# Altium schematic sheet TailLights.SchDoc
size Letter; Organization: Midnight Sun Solar Rayce Car Team; Address1: University of Waterloo; Address2: 200 University Ave W; Address3: Waterloo, ON, Canada; Address4: N2L 3E9; Website: www.uwmidsun.com
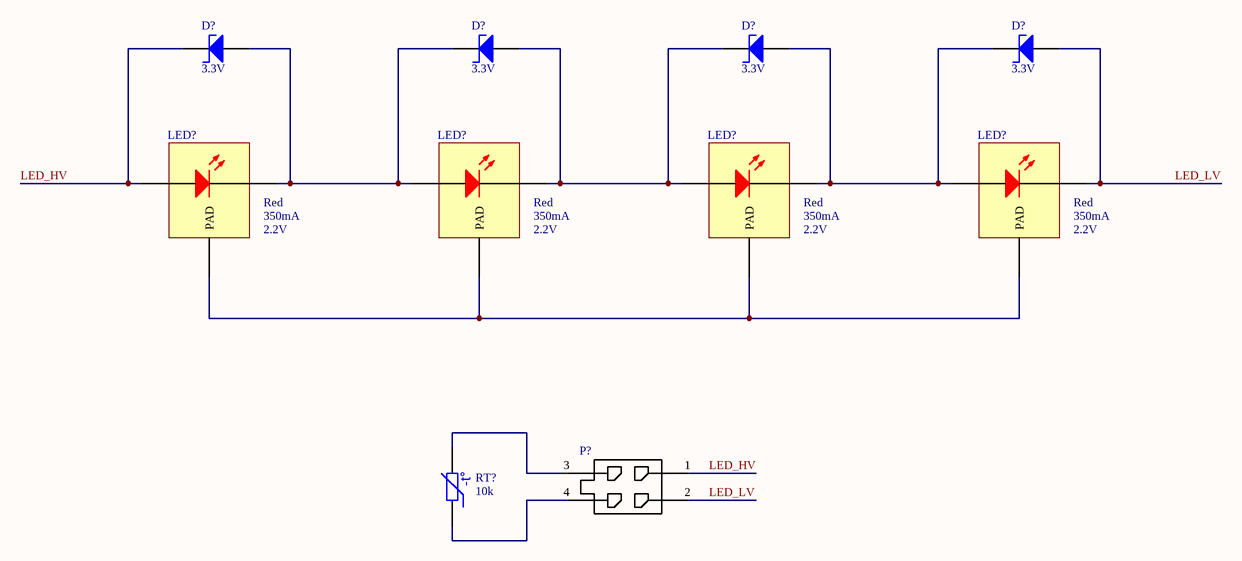
[diagram p0: TailLights.SchDoc]

## Parts
(Parts that share a designator on the sheet are numbered #1, #2 ... from top to bottom, then left to right.)
D?#1  Zener Voltage: 3.3V  [DO-214AA Diode]  (hidden comment: DIODE ZENER 3.3V 3W DO-214AA)
D?#2  Zener Voltage: 3.3V  [DO-214AA Diode]  (hidden comment: DIODE ZENER 3.3V 3W DO-214AA)
D?#3  Zener Voltage: 3.3V  [DO-214AA Diode]  (hidden comment: DIODE ZENER 3.3V 3W DO-214AA)
D?#4  Zener Voltage: 3.3V  [DO-214AA Diode]  (hidden comment: DIODE ZENER 3.3V 3W DO-214AA)
LED?#1  Color: Red  Test Current: 350mA  Forward Voltage: 2.2V  [LED XLAMP XP-E2 1414]  (hidden comment: LED RED XLAMP XP-E2 1414)
LED?#2  Color: Red  Test Current: 350mA  Forward Voltage: 2.2V  [LED XLAMP XP-E2 1414]  (hidden comment: LED RED XLAMP XP-E2 1414)
LED?#3  Color: Red  Test Current: 350mA  Forward Voltage: 2.2V  [LED XLAMP XP-E2 1414]  (hidden comment: LED RED XLAMP XP-E2 1414)
LED?#4  Color: Red  Test Current: 350mA  Forward Voltage: 2.2V  [LED XLAMP XP-E2 1414]  (hidden comment: LED RED XLAMP XP-E2 1414)
P?  CONN 4POS MICRO-FIT 3mm  [CONN 4POS MICROFIT (2x2)]  (value not drawn)
RT?  Resistance in Ohms @ 25°C: 10k  [RES, 0603]  (hidden comment: NTC THERMISTORS 10K 0603 SMD)

## Nets
LED_HV: D?#1.2(K) LED?#1.1(A) P?.1
LED_LV: D?#4.1(A) LED?#4.3(K) P?.2
NetD?#1_1: D?#1.1(A) D?#2.2(K) LED?#1.3(K) LED?#2.1(A)
NetD?#2_1: D?#2.1(A) D?#3.2(K) LED?#2.3(K) LED?#3.1(A)
NetD?#3_1: D?#3.1(A) D?#4.2(K) LED?#3.3(K) LED?#4.1(A)
NetLED?#1_2: LED?#1.2(PAD) LED?#2.2(PAD) LED?#3.2(PAD) LED?#4.2(PAD)
NetP?_3: P?.3 RT?.2
NetP?_4: P?.4 RT?.1

## Notes on the sheet
- Project:
- Title:
- Size:
- Project Author
- Letter
- Revision:
- University of Waterloo
- 200 University Ave W
- Waterloo, ON, Canada
- N2L 3E9
- Date:
- Sheet
- of
- Website:
- (in symbol NTC THERMISTORS 10K 0603 SMD) -t°

## Library data of the parts
D?#1-D?#4 = DIODE ZENER 3.3V 3W DO-214AA: Diode Zener Single 3.3V 5% 3000mW Automotive 2-Pin SMB T/R; Manufacturer: ON Semiconductor; Manufacturer Part Number: SZ1SMB5913BT3G; Max Power Dissipation: 550mW; Zener Current: 100uA; Forward Voltage: 1.5V; Impedance: 10R; Test Current: 113.6mA; Supplier 1: Digi-Key; RoHS: Yes; Category: Zener Diodes; Stock 1: 2894; Pricing 1: 1=0.62000, 10=0.54500, 25=0.51160, 100=0.37130, 250=0.35804, 500=0.31020, 1000=0.26400 (USD); Case/Package: SMB; Number of Pins: 2; Min Operating Temperature: -65°C; Max Operating Temperature: 150°C; Tolerance: 5%; Package Quantity: 2500; Peak Reverse Current: 100uA; Voltage Tolerance: 5%; Power Dissipation: 550mW; Max Reverse Leakage Current: 100uA; Element Configuration: Single; Packaging: Tape and Reel; Length: 4.32mm; Height: 2.3mm; Width: 3.56mm; Radiation Hardening: No; Lead Free: Lead Free; Halogen Free: Halogen Free; ComponentLink1URL: http://www.mouser.com/ds/2/308/1SMB5913BT3-D-108682.pdf?src-supplier=Mouser; ComponentLink1Description: http://www.mouser.com/ds/2/308/1SMB5913BT3-D-108682.pdf?src-supplier=Mouser; ComponentLink2URL: https://www.onsemi.com/pub/Collateral/1SMB5913BT3-D.PDF?src-supplier=Digi-Key; ComponentLink2Description: https://www.onsemi.com/pub/Collateral/1SMB5913BT3-D.PDF?src-supplier=Digi-Key; ComponentLink3URL: http://www.farnell.com/datasheets/2160707.pdf?src-supplier=Newark; ComponentLink3Description: http://www.farnell.com/datasheets/2160707.pdf?src-supplier=Newark; ComponentLink4URL: http://www.onsemi.com/pub/Collateral/1SMB5913BT3-D.PDF?src-supplier=Avnet; ComponentLink4Description: http://www.onsemi.com/pub/Collateral/1SMB5913BT3-D.PDF?src-supplier=Avnet; Supplier Part Number 1: SZ1SMB5913BT3GOSCT-ND
LED?#1-LED?#4 = LED RED XLAMP XP-E2 1414: LED Lighting Color XLamp® XP-E2 Red 623nm (620nm ~ 625nm) 1414 (3535 Metric); Manufacturer: Cree; Manufacturer Part Number: XPEBRD-L1-0000-00902; Max Current Rating: 1A; Test Temperature: 25°C; Viewing Angle: 130°; Thermal Resistance of Package: 5°C/W; Supplier 1: Digi-Key; Stock 1: 1640; Pricing 1: 1 = 2.00000, 10 = 1.90000, 100 = 1.69980, 250 = 1.54584, 500 = 1.44786 (USD); Mount: Surface Mount; Case/Package: SMD/SMT; Packaging: Tape and Reel; Wavelength: 625nm; Lead Free: Lead Free; Supplier Part Number 1: XPEBRD-L1-0000-00902CT-ND; RoHS: Yes
P? = CONN 4POS MICRO-FIT 3mm: Micro-Fit 3.0 Vertical Header, 3.00mm Pitch, Dual Row, 4 Circuits, with PCB Polarizing Peg, Tin, Glow-Wire Capable, Black; Manufacturer: Molex, LLC; Manufacturer Part Number: 0430450827; Pitch - Mating: 0.118" (3.00mm); Number of Positions: 6; Number of Positions Loaded: All; Style: Board to Cable/Wire; Shrouding: Shrouded - 4 Wall; Contact Length - Post: 0.125" (3.18mm); Material Flammability Rating: UL94 V-0; Contact Resistance: 10mR; Number of Contacts: 4; Number of Ports: 1; Row Spacing: 0.118inch; RoHS: RoHS Compliant; Category: Connectors, Interconnects; Packaging: Tray; Part Status: Active; Connector Type: Header; Contact Type: Male Pin; Number of Rows: 2; Row Spacing - Mating: 0.118" (3.00mm); Mounting Type: Through Hole; Termination: Solder; Fastening Type: Locking Ramp; Contact Length - Mating: -; Overall Contact Length: -; Insulation Height: 0.390" (9.91mm); Contact Shape: Square; Contact Finish - Mating: Tin; Contact Finish Thickness - Mating: 60.0µin (1.52µm); Contact Finish - Post: Tin; Contact Material: Brass; Insulation Material: Liquid Crystal Polymer (LCP), Glass Filled; Features: Board Guide; Operating Temperature: -; Ingress Protection: -; Insulation Color: Black; Current Rating: -; Voltage Rating: -; Mated Stacking Heights: -; Contact Finish Thickness - Post: -; Applications: General Purpose, Medical, Military, Telecommunications; ComponentLink1URL: https://www.molex.com/pdm_docs/sd/430450627_sd.pdf; ComponentLink1Description: https://www.molex.com/pdm_docs/sd/430450627_sd.pdf; ComponentLink2URL: https://www.molex.com/pdm_docs/sd/430450827_sd.pdf; ComponentLink2Description: https://www.molex.com/pdm_docs/sd/430450827_sd.pdf; Mount: Through Hole; Contact Plating: Tin; Housing Material: Polymer; Color: Black; Number of Terminals: 4; Housing Color: Black; Min Operating Temperature: -40°C; Max Operating Temperature: 105°C; Package Quantity: 2232; Orientation: Straight; Length: 10.15mm; Pitch: 3mm; Depth: 8.77mm; ComponentLink3URL: http://www.molex.com/pdm_docs/sd/430450427_sd.pdf; ComponentLink3Description: http://www.molex.com/pdm_docs/sd/430450427_sd.pdf; ComponentLink4URL: http://www.molex.com/webdocs/datasheets/pdf/en-us/0430450427_PCB_HEADERS.pdf; ComponentLink4Description: http://www.molex.com/webdocs/datasheets/pdf/en-us/0430450427_PCB_HEADERS.pdf; Supplier 1: Digi-Key; Supplier Part Number 1: WM10667-ND
RT? = NTC THERMISTORS 10K 0603 SMD: NTC THERMISTORS 10KOHM 1608 SMD; Manufacturer: Murata Electronics North America; Manufacturer Part Number: NCU18XH103F60RB; Resistance Tolerance: ±1%; B25/50: 3380K; B25/85: 3434K; B25/100: 3455K; Supplier 1: Digi-Key; RoHS: Request Inventory Verification; Category: Sensors, Transducers; Stock 1: 0; Pricing 1: 4000=0.06771, 8000=0.05974, 12000=0.05775, 20000=0.05675, 28000=0.05576 (CAD); Packaging: Tape & Reel (TR); Part Status: Active; B Value Tolerance: ±1%; B0/50: -; B25/75: -; Operating Temperature: -40°C ~ 125°C; Length - Lead Wire: -; Mounting Type: Surface Mount; Package / Case: 0603 (1608 Metric); ComponentLink1URL: https://www.murata.com/~/media/webrenewal/support/library/catalog/products/thermistor/r03e.ashx; ComponentLink1Description: https://www.murata.com/~/media/webrenewal/support/library/catalog/products/thermistor/r03e.ashx; Supplier Part Number 1: 490-16279-2-ND